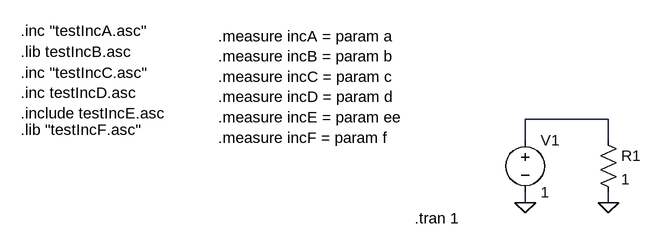
[diagram p0: schematic testInc1.asc]
testInc1.asc, the LTspice schematic file:
Version 4
SHEET 1 880 680
WIRE 288 128 160 128
WIRE 160 160 160 128
WIRE 288 160 288 128
WIRE 160 256 160 240
WIRE 288 256 288 240
FLAG 160 256 0
FLAG 288 256 0
SYMBOL voltage 160 144 R0
SYMATTR InstName V1
SYMATTR Value 1
SYMBOL res 272 144 R0
SYMATTR InstName R1
SYMATTR Value 1
TEXT -616 -8 Left 2 !.inc "testIncA.asc"
TEXT -616 24 Left 2 !.lib testIncB.asc
TEXT -616 56 Left 2 !.inc "testIncC.asc"\n.inc testIncD.asc\n.include testIncE.asc
TEXT -10 280 Left 2 !.tran 1
TEXT -616 144 Left 2 !.lib "testIncF.asc"
TEXT -312 0 Left 2 !.measure incA = param a\n.measure incB = param b\n.measure incC = param c\n.measure incD = param d\n.measure incE = param ee\n.measure incF = param f

The netlist it stands for:
* testInc1.asc
V1 N001 0 1
R1 N001 0 1
.inc "testIncA.asc"
.lib testIncB.asc
.inc "testIncC.asc"
.inc testIncD.asc
.include testIncE.asc
.tran 1
.lib "testIncF.asc"
.measure incA = param a
.measure incB = param b
.measure incC = param c
.measure incD = param d
.measure incE = param ee
.measure incF = param f
.backanno
.end